# Altium schematic sheet DRS4-TOP.SchDoc: UCLA-DRS4
size Letter; Organization: University of California; Address1: 475 Portola Plaza; Address2: Los Angeles, CA 90095; Revision: R01; SheetNumber: 1; SheetTotal: 1
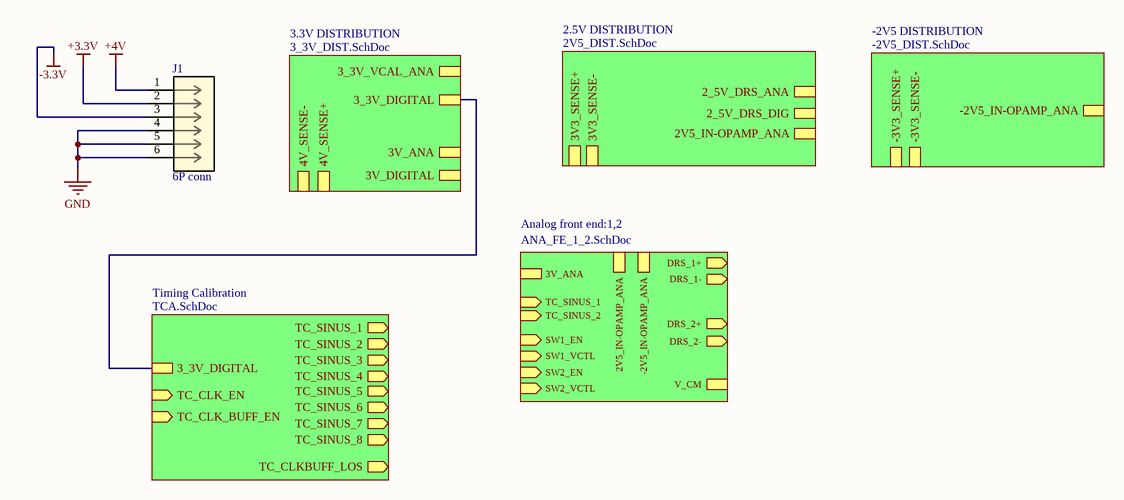
[diagram p0: DRS4-TOP.SchDoc]

## Parts
J1  6P conn  [CONN_1586041-6_T]

## Sub-sheets
2.5V DISTRIBUTION = 2V5_DIST.SchDoc: 2_5V_DRS_ANA, 2_5V_DRS_DIG, 3V3_SENSE+, 3V3_SENSE-, 2V5_IN-OPAMP_ANA
3.3V DISTRIBUTION = 3_3V_DIST.SchDoc: 4V_SENSE+, 4V_SENSE-, 3_3V_VCAL_ANA, 3_3V_DIGITAL, 3V_ANA, 3V_DIGITAL
-2V5 DISTRIBUTION = -2V5_DIST.SchDoc: -3V3_SENSE+, -3V3_SENSE-, -2V5_IN-OPAMP_ANA
Analog front end:1,2 = ANA_FE_1_2.SchDoc: SW1_VCTL (in), TC_SINUS_1 (in), TC_SINUS_2 (in), 3V_ANA, SW1_EN (in), 2V5_IN-OPAMP_ANA, -2V5_IN-OPAMP_ANA, DRS_1+ (out), DRS_2+ (out), DRS_1- (out), DRS_2- (out), V_CM, SW2_EN (in), SW2_VCTL (in)
Timing Calibration = TCA.SchDoc: 3_3V_DIGITAL, TC_CLK_EN (in), TC_CLKBUFF_LOS (out), TC_CLK_BUFF_EN (in), TC_SINUS_1 (out), TC_SINUS_2 (out), TC_SINUS_3 (out), TC_SINUS_4 (out), TC_SINUS_5 (out), TC_SINUS_6 (out), TC_SINUS_7 (out), TC_SINUS_8 (out)

## Nets
+3.3V: J1.2
+4V: J1.1
-3.3V: J1.3
GND: J1.4 J1.5 J1.6
(unnamed): sheet 3.3V DISTRIBUTION/3_3V_DIGITAL, sheet Timing Calibration/3_3V_DIGITAL

## Notes on the sheet
- 475 Portola Plaza
- GAPS TOF
- Title
- igarcia91@g.ucla.edu
- Los Angeles, CA
- 310-825-0344
- Size:
- Date:
- Letter
- Number:
- Time:
- Sheet
- Revision:
- of
- andrew.peck@cern.ch
- spq@ucla.edu
- File:

## Library data of the parts
J1 = 1586041-6: Headers & Wire Housings RA HDR W/O PEGS 6P; Vendor: TE Connectivity; Built_By: EMA_UL_Team; C: Copyright (C) 2015 Accelerated Designs. All rights reserved; Manufacturer_Part_Number: 1586041-6; Copyright: Copyright (C) 2016 Accelerated Designs. All rights reserved; RefDes: RefDes; Type: DEV; Value: Value